# Altium schematic sheet digital_input_shifter.SchDoc: Digital Input Breakout Board - Level Clipper
size Letter; Revision: 1.0; SheetNumber: 2; SheetTotal: 2; Client: Facebook; LeaflabsProject: Sawyer
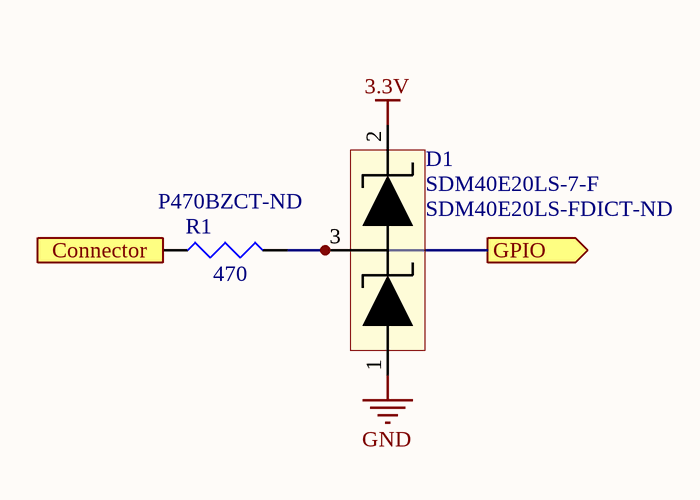
[diagram p0: digital_input_shifter.SchDoc]

## Parts
D1  SDM40E20LS-7-F  Supplier Part Number 1: SDM40E20LS-FDICT-ND  [SOT-23_N]
R1  value 470  Supplier Part Number 1: P470BZCT-ND  [J1-0603]  (hidden comment: Res3)

## Ports
Connector (in), GPIO (out)

## Nets
3.3V: D1.2
GND: D1.1
Connector: R1.1 ; port Connector
GPIO: D1.3 R1.2 ; port GPIO

## Notes on the sheet
- PROJ
- TITLE
- CLIENT
- REV
- DATE
- LeafLabs
- SHEET
- OF
- CONFIDENTIAL. DO NOT DISTRIBUTE.

## Library data of the parts
D1 = SDM40E20LS-7-F: SDM40E20LS-7-F schottky series pair diode.; Supplier 1: Digi-Key
R1 = Res3: Resistor; Published: 8-Jun-2000; LatestRevisionDate: 29-May-2009; LatestRevisionNote: IPC-7351 Footprint Added.; PackageReference: J1-0603; Publisher: Altium Limited; PackageDescription: Chip Resistor; Supplier 1: Digi-Key